# EAGLE board 7x7RGB-IR-J010129A (EAGLE 7.7.0), part 1 of 2
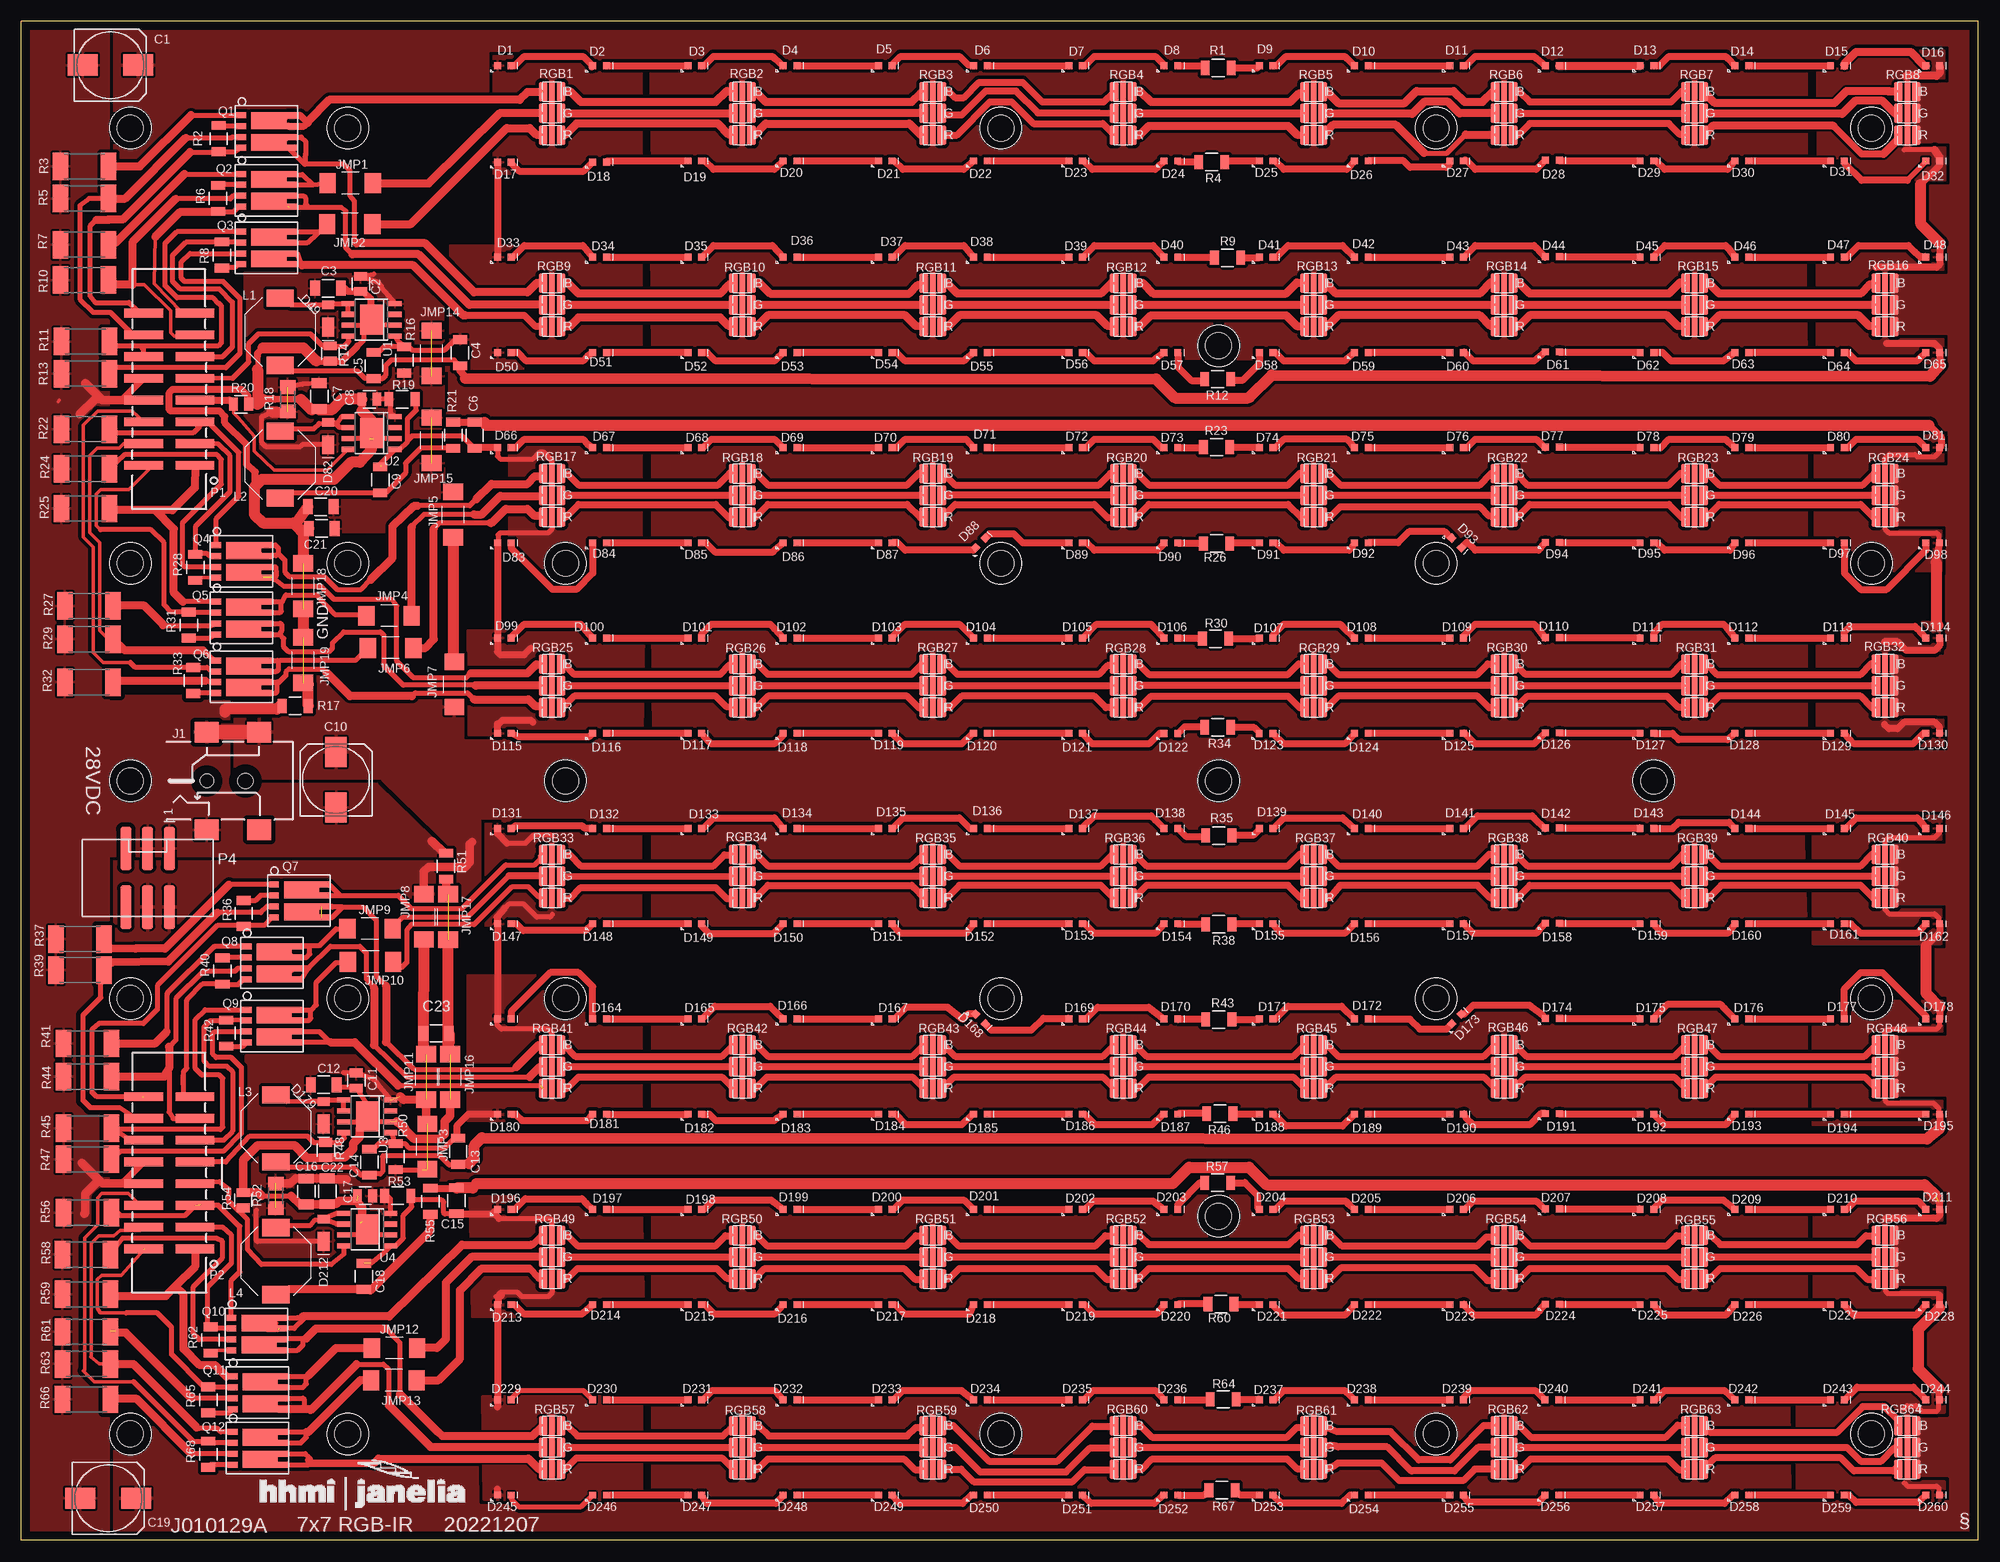
[diagram p4: board, top side]

Size 228.35 x 177.29 mm. Coordinates in mm from the lower left corner, seen from the top.
Outline: 228.35,177.29 0,177.29 0,0 228.35,0 228.35,177.29
Copper layers (1*16): Top 0.035mm / dielectric 1.5mm / Bottom 0.035mm
Design rules "default": minimum track width 10mil, minimum drill 24mil, track to track 8mil, track to pad 8mil, pad to pad 8mil, via to via 8mil, smd to smd 8mil, copper to edge 40mil, drill to drill 8mil, minimum pad ring 10mil, minimum via ring 8mil, stop-mask expansion 4mil, vias tented up to drill 0mil, thermal gap 10mil

## Footprints (pad centres in the part's own frame; a part is rotated, then mirrored left to right if it is on the bottom)
153CLV-0810 = smd 3.5 x 2.5: + 3.25,0; - -3.25,0
0805S = smd 1.016 x 1.524: 1 -0.889,0; 2 0.889,0
1210S = smd 1.14 x 1.75: 1 -1.5,0; 2 1.5,0
1206S = smd 1.016 x 1.651: 1 -1.524,0; 2 1.524,0
LED_SFH4050 = smd 0.8 x 0.8: A -0.8,0; C 0.8,0
PWRDI-123 = smd 1 x 1.4: A 1.6,0 | smd 2.2 x 1.4: K -1,0
PJ-002 = smd 2.8 x 2.4: 1A 5,5.7; 1B 11.1,5.7; 2 5,-5.7; 3 11.1,-5.7 | hole 1.6: 5,0 | hole 1.8: 9.5,0
5100 = smd 1.91 x 2.31: 1 -2.65,0; 2 2.65,0
SRU8043 = smd 2.007 x 3.2: 1 -3.912,0; 2 3.912,0
HEADER2X8_SM_SMALL = smd 1.02 x 4.5: 1 -8.89,-3; 2 -8.89,3; 3 -6.35,-3; 4 -6.35,3; 5 -3.81,-3; 6 -3.81,3; 7 -1.27,-3; 8 -1.27,3; 9 1.27,-3; 10 1.27,3; 11 3.81,-3; 12 3.81,3; 13 6.35,-3; 14 6.35,3; 15 8.89,-3; 16 8.89,3
2X3_SHROUDED_SMT = smd 5.08 x 1.27: 1 -3.429,2.54; 2 3.429,2.54; 3 -3.429,0; 4 3.429,0; 5 -3.429,-2.54; 6 3.429,-2.54
LFPAK56D = smd 0.7 x 1.15: 1 -1.905,-3.275; 2 -0.635,-3.275; 3 0.635,-3.275; 4 1.905,-3.275 | smd 0.7 x 1.9: 5 1.905,2.225; 6 0.635,2.225; 7 -0.635,2.225; 8 -1.905,2.225 | smd 1.97 x 4.1: 56 1.27,-0.05; 78 -1.27,-0.05
R2512 = smd 1.8 x 3.2: 1 -2.8,0; 2 2.8,0
R1206 = smd 1.6 x 1.803: 1 -1.422,0; 2 1.422,0
SUNPLUS_RGB = smd 1 x 2.286: BA -1.05,-2.54; BC 1.05,-2.54; GA -1.05,0; GC 1.05,0; RA -1.05,2.54; RC 1.05,2.54 | smd 0.69 x 7.62: T 0,0
4-40SOCKET = hole 3.048: 0,0
SOIC8-EP = smd 0.6 x 1.5: 1 -1.905,-2.75; 2 -0.635,-2.75; 3 0.635,-2.75; 4 1.905,-2.75; 5 1.905,2.75; 6 0.635,2.75; 7 -0.635,2.75; 8 -1.905,2.75 | smd 3.502 x 2.613: EP 0,0

## Placement (x,y rotation side)
C1  [153CLV-0810]  10.39,172.18 0 top
C2  0.1  [0805S]  39.6,146.66 270 top
C3  10@50  [1210S]  35.79,146.15 0 top
C4  2.2@50  [1206S]  51.18,138.62 270 top
C5  2.2@50  [1206S]  41.12,137.13 270 top
C6  2.2@50  [1206S]  52.89,128.99 90 top
C7  10@50  [1210S]  34.77,133.58 270 top
C8  0.1  [0805S]  40.61,133.19 180 top
C9  2.2@50  [1206S]  41.88,123.8 270 top
C10  [153CLV-0810]  36.7,88.77 90 top
C11  0.1  [0805S]  39.09,53.69 270 top
C12  10@50  [1210S]  35.28,53.18 0 top
C13  2.2@50  [1206S]  50.96,45.43 270 top
C14  2.2@50  [1206S]  40.61,44.17 270 top
C15  2.2@50  [1206S]  50.77,39.66 90 top
C16  10@50  [1210S]  33.25,40.74 270 top
C17  0.1  [0805S]  40.1,40.23 180 top
C18  2.2@50  [1206S]  39.98,30.83 270 top
C19  [153CLV-0810]  10.13,4.92 0 top
C20  10@50  [1210S]  34.92,120.65 180 top
C21  10@50  [1210S]  35.05,118.11 180 top
C22  10@50  [1210S]  35.69,40.77 270 top
C23  10@50  [1210S]  48.39,59.18 0 top
D1  [LED_SFH4050]  56.36,172.11 0 top
D2  [LED_SFH4050]  67.47,172.11 0 top
D3  [LED_SFH4050]  78.58,172.12 0 top
D4  [LED_SFH4050]  89.7,172.12 0 top
D5  [LED_SFH4050]  100.81,172.12 0 top
D6  [LED_SFH4050]  111.92,172.12 0 top
D7  [LED_SFH4050]  123.03,172.12 0 top
D8  [LED_SFH4050]  134.15,172.12 0 top
D9  [LED_SFH4050]  145.26,172.12 0 top
D10  [LED_SFH4050]  156.37,172.12 0 top
D11  [LED_SFH4050]  167.48,172.12 0 top
D12  [LED_SFH4050]  178.66,172.12 0 top
D13  [LED_SFH4050]  189.71,172.12 0 top
D14  [LED_SFH4050]  200.78,172.12 0 top
D15  [LED_SFH4050]  211.93,172.12 0 top
D16  [LED_SFH4050]  223.05,172.12 0 top
D17  [LED_SFH4050]  56.36,160.88 0 top
D18  [LED_SFH4050]  67.47,160.88 0 top
D19  [LED_SFH4050]  78.58,161.01 0 top
D20  [LED_SFH4050]  89.7,161.01 0 top
D21  [LED_SFH4050]  100.81,161.01 0 top
D22  [LED_SFH4050]  111.92,161.01 0 top
D23  [LED_SFH4050]  123.03,161.01 0 top
D24  [LED_SFH4050]  134.15,161.01 0 top
D25  [LED_SFH4050]  145.26,161.01 0 top
D26  [LED_SFH4050]  156.37,161.01 0 top
D27  [LED_SFH4050]  167.48,161.01 0 top
D28  [LED_SFH4050]  178.66,161.08 0 top
D29  [LED_SFH4050]  189.71,161.01 0 top
D30  [LED_SFH4050]  200.78,161.01 0 top
D31  [LED_SFH4050]  211.93,161.01 0 top
D32  [LED_SFH4050]  223.05,161.01 0 top
D33  [LED_SFH4050]  56.36,149.77 0 top
D34  [LED_SFH4050]  67.47,149.77 0 top
D35  [LED_SFH4050]  78.58,149.77 0 top
D36  [LED_SFH4050]  89.7,149.77 0 top
D37  [LED_SFH4050]  100.81,149.77 0 top
D38  [LED_SFH4050]  111.92,149.77 0 top
D39  [LED_SFH4050]  123.03,149.77 0 top
D40  [LED_SFH4050]  134.15,149.77 0 top
D41  [LED_SFH4050]  145.26,149.77 0 top
D42  [LED_SFH4050]  156.37,149.77 0 top
D43  [LED_SFH4050]  167.48,149.77 0 top
D44  [LED_SFH4050]  178.66,149.84 0 top
D45  [LED_SFH4050]  189.71,149.77 0 top
D46  [LED_SFH4050]  200.78,149.77 0 top
D47  [LED_SFH4050]  211.93,149.77 0 top
D48  [LED_SFH4050]  223.05,149.77 0 top
D49  DLFS240L  [PWRDI-123]  35.79,142.59 90 top
D50  [LED_SFH4050]  56.36,138.66 0 top
D51  [LED_SFH4050]  67.47,138.66 0 top
D52  [LED_SFH4050]  78.58,138.66 0 top
D53  [LED_SFH4050]  89.7,138.66 0 top
D54  [LED_SFH4050]  100.81,138.66 0 top
D55  [LED_SFH4050]  111.92,138.66 0 top
D56  [LED_SFH4050]  123.03,138.66 0 top
D57  [LED_SFH4050]  134.15,138.66 0 top
D58  [LED_SFH4050]  145.26,138.66 0 top
D59  [LED_SFH4050]  156.37,138.66 0 top
D60  [LED_SFH4050]  167.48,138.66 0 top
D61  [LED_SFH4050]  178.66,138.73 0 top
D62  [LED_SFH4050]  189.71,138.66 0 top
D63  [LED_SFH4050]  200.78,138.66 0 top
D64  [LED_SFH4050]  211.93,138.66 0 top
D65  [LED_SFH4050]  223.05,138.66 0 top
D66  [LED_SFH4050]  56.36,127.55 0 top
D67  [LED_SFH4050]  67.47,127.55 0 top
D68  [LED_SFH4050]  78.58,127.55 0 top
D69  [LED_SFH4050]  89.7,127.55 0 top
D70  [LED_SFH4050]  100.81,127.55 0 top
D71  [LED_SFH4050]  111.92,127.55 0 top
D72  [LED_SFH4050]  123.03,127.55 0 top
D73  [LED_SFH4050]  134.15,127.55 0 top
D74  [LED_SFH4050]  145.26,127.55 0 top
D75  [LED_SFH4050]  156.37,127.55 0 top
D76  [LED_SFH4050]  167.48,127.55 0 top
D77  [LED_SFH4050]  178.66,127.62 0 top
D78  [LED_SFH4050]  189.71,127.55 0 top
D79  [LED_SFH4050]  200.78,127.55 0 top
D80  [LED_SFH4050]  211.93,127.55 0 top
D81  [LED_SFH4050]  223.05,127.55 0 top
D82  DLFS240L  [PWRDI-123]  35.79,128.88 90 top
D83  [LED_SFH4050]  56.36,116.43 0 top
D84  [LED_SFH4050]  67.47,116.43 0 top
D85  [LED_SFH4050]  78.58,116.43 0 top
D86  [LED_SFH4050]  89.7,116.43 0 top
D87  [LED_SFH4050]  100.81,116.43 0 top
D88  [LED_SFH4050]  111.92,116.43 45 top
D89  [LED_SFH4050]  123.03,116.43 0 top
D90  [LED_SFH4050]  134.15,116.43 0 top
D91  [LED_SFH4050]  145.26,116.43 0 top
D92  [LED_SFH4050]  156.37,116.43 0 top
D93  [LED_SFH4050]  167.48,116.43 315 top
D94  [LED_SFH4050]  178.66,116.5 0 top
D95  [LED_SFH4050]  189.71,116.43 0 top
D96  [LED_SFH4050]  200.78,116.43 0 top
D97  [LED_SFH4050]  211.93,116.43 0 top
D98  [LED_SFH4050]  223.05,116.43 0 top
D99  [LED_SFH4050]  56.36,105.32 0 top
D100  [LED_SFH4050]  67.47,105.32 0 top
D101  [LED_SFH4050]  78.58,105.32 0 top
D102  [LED_SFH4050]  89.7,105.32 0 top
D103  [LED_SFH4050]  100.81,105.32 0 top
D104  [LED_SFH4050]  111.92,105.32 0 top
D105  [LED_SFH4050]  123.03,105.32 0 top
D106  [LED_SFH4050]  134.15,105.32 0 top
D107  [LED_SFH4050]  145.26,105.32 0 top
D108  [LED_SFH4050]  156.37,105.32 0 top
D109  [LED_SFH4050]  167.48,105.32 0 top
D110  [LED_SFH4050]  178.66,105.39 0 top
D111  [LED_SFH4050]  189.71,105.32 0 top
D112  [LED_SFH4050]  200.78,105.32 0 top
D113  [LED_SFH4050]  211.93,105.32 0 top
D114  [LED_SFH4050]  223.05,105.32 0 top
D115  [LED_SFH4050]  56.36,94.21 0 top
D116  [LED_SFH4050]  67.47,94.21 0 top
D117  [LED_SFH4050]  78.58,94.21 0 top
D118  [LED_SFH4050]  89.7,94.21 0 top
D119  [LED_SFH4050]  100.81,94.21 0 top
D120  [LED_SFH4050]  111.92,94.21 0 top
D121  [LED_SFH4050]  123.03,94.21 0 top
D122  [LED_SFH4050]  134.15,94.2 0 top
D123  [LED_SFH4050]  145.26,94.2 0 top
D124  [LED_SFH4050]  156.37,94.21 0 top
D125  [LED_SFH4050]  167.48,94.21 0 top
D126  [LED_SFH4050]  178.66,94.28 0 top
D127  [LED_SFH4050]  189.71,94.21 0 top
D128  [LED_SFH4050]  200.78,94.21 0 top
D129  [LED_SFH4050]  211.93,94.21 0 top
D130  [LED_SFH4050]  223.05,94.21 0 top
D131  [LED_SFH4050]  56.36,83.09 0 top
D132  [LED_SFH4050]  67.47,83.09 0 top
D133  [LED_SFH4050]  78.58,83.09 0 top
D134  [LED_SFH4050]  89.7,83.09 0 top
D135  [LED_SFH4050]  100.81,83.09 0 top
D136  [LED_SFH4050]  111.92,83.09 0 top
D137  [LED_SFH4050]  123.03,83.09 0 top
D138  [LED_SFH4050]  134.14,83.09 0 top
D139  [LED_SFH4050]  145.26,83.09 0 top
D140  [LED_SFH4050]  156.37,83.09 0 top
D141  [LED_SFH4050]  167.48,83.09 0 top
D142  [LED_SFH4050]  178.66,83.16 0 top
D143  [LED_SFH4050]  189.71,83.09 0 top
D144  [LED_SFH4050]  200.78,83.09 0 top
D145  [LED_SFH4050]  211.93,83.09 0 top
D146  [LED_SFH4050]  223.05,83.09 0 top
D147  [LED_SFH4050]  56.36,71.98 0 top
D148  [LED_SFH4050]  67.47,71.98 0 top
D149  [LED_SFH4050]  78.58,71.98 0 top
D150  [LED_SFH4050]  89.7,71.98 0 top
D151  [LED_SFH4050]  100.81,71.98 0 top
D152  [LED_SFH4050]  111.92,71.98 0 top
D153  [LED_SFH4050]  123.03,71.98 0 top
D154  [LED_SFH4050]  134.15,71.98 0 top
D155  [LED_SFH4050]  145.26,71.98 0 top
D156  [LED_SFH4050]  156.37,71.98 0 top
D157  [LED_SFH4050]  167.48,71.98 0 top
D158  [LED_SFH4050]  178.66,72.05 0 top
D159  [LED_SFH4050]  189.71,71.98 0 top
D160  [LED_SFH4050]  200.78,71.98 0 top
D161  [LED_SFH4050]  211.93,71.98 0 top
D162  [LED_SFH4050]  223.05,71.98 0 top
D163  [LED_SFH4050]  56.36,60.87 0 top
D164  [LED_SFH4050]  67.47,60.87 0 top
D165  [LED_SFH4050]  78.58,60.87 0 top
D166  [LED_SFH4050]  89.7,60.87 0 top
D167  [LED_SFH4050]  100.81,60.87 0 top
D168  [LED_SFH4050]  111.92,60.87 315 top
D169  [LED_SFH4050]  123.03,60.87 0 top
D170  [LED_SFH4050]  134.15,60.87 0 top
D171  [LED_SFH4050]  145.26,60.87 0 top
D172  [LED_SFH4050]  156.37,60.87 0 top
D173  [LED_SFH4050]  167.48,60.87 45 top
D174  [LED_SFH4050]  178.66,60.94 0 top
D175  [LED_SFH4050]  189.71,60.87 0 top
D176  [LED_SFH4050]  200.78,60.87 0 top
D177  [LED_SFH4050]  211.93,60.87 0 top
D178  [LED_SFH4050]  223.05,60.87 0 top
D179  DLFS240L  [PWRDI-123]  35.28,49.63 90 top
D180  [LED_SFH4050]  56.36,49.76 0 top
D181  [LED_SFH4050]  67.47,49.76 0 top
D182  [LED_SFH4050]  78.58,49.76 0 top
D183  [LED_SFH4050]  89.7,49.76 0 top
D184  [LED_SFH4050]  100.81,49.76 0 top
D185  [LED_SFH4050]  111.92,49.76 0 top
D186  [LED_SFH4050]  123.03,49.76 0 top
D187  [LED_SFH4050]  134.15,49.76 0 top
D188  [LED_SFH4050]  145.26,49.76 0 top
D189  [LED_SFH4050]  156.37,49.76 0 top
D190  [LED_SFH4050]  167.48,49.76 0 top
D191  [LED_SFH4050]  178.66,49.83 0 top
D192  [LED_SFH4050]  189.71,49.76 0 top
D193  [LED_SFH4050]  200.78,49.76 0 top
D194  [LED_SFH4050]  211.93,49.76 0 top
D195  [LED_SFH4050]  223.05,49.76 0 top
D196  [LED_SFH4050]  56.36,38.64 0 top
D197  [LED_SFH4050]  67.47,38.64 0 top
D198  [LED_SFH4050]  78.58,38.64 0 top
D199  [LED_SFH4050]  89.7,38.64 0 top
D200  [LED_SFH4050]  100.81,38.64 0 top
D201  [LED_SFH4050]  111.92,38.64 0 top
D202  [LED_SFH4050]  123.03,38.64 0 top
D203  [LED_SFH4050]  134.15,38.64 0 top
D204  [LED_SFH4050]  145.26,38.64 0 top
D205  [LED_SFH4050]  156.37,38.64 0 top
D206  [LED_SFH4050]  167.48,38.64 0 top
D207  [LED_SFH4050]  178.66,38.71 0 top
D208  [LED_SFH4050]  189.71,38.64 0 top
D209  [LED_SFH4050]  200.78,38.64 0 top
D210  [LED_SFH4050]  211.93,38.64 0 top
D211  [LED_SFH4050]  223.05,38.64 0 top
D212  DLFS240L  [PWRDI-123]  35.28,35.91 90 top
D213  [LED_SFH4050]  56.36,27.53 0 top
D214  [LED_SFH4050]  67.47,27.53 0 top
D215  [LED_SFH4050]  78.58,27.53 0 top
D216  [LED_SFH4050]  89.7,27.53 0 top
D217  [LED_SFH4050]  100.81,27.53 0 top
D218  [LED_SFH4050]  111.92,27.53 0 top
D219  [LED_SFH4050]  123.03,27.53 0 top
D220  [LED_SFH4050]  134.15,27.53 0 top
D221  [LED_SFH4050]  145.26,27.53 0 top
D222  [LED_SFH4050]  156.37,27.53 0 top
D223  [LED_SFH4050]  167.48,27.53 0 top
D224  [LED_SFH4050]  178.66,27.6 0 top
D225  [LED_SFH4050]  189.71,27.53 0 top
D226  [LED_SFH4050]  200.78,27.53 0 top
D227  [LED_SFH4050]  211.93,27.53 0 top
D228  [LED_SFH4050]  223.05,27.53 0 top
D229  [LED_SFH4050]  56.36,16.41 0 top
D230  [LED_SFH4050]  67.47,16.41 0 top
D231  [LED_SFH4050]  78.58,16.41 0 top
D232  [LED_SFH4050]  89.7,16.41 0 top
D233  [LED_SFH4050]  100.81,16.41 0 top
D234  [LED_SFH4050]  111.92,16.41 0 top
D235  [LED_SFH4050]  123.03,16.41 0 top
D236  [LED_SFH4050]  134.15,16.41 0 top
D237  [LED_SFH4050]  145.26,16.41 0 top
D238  [LED_SFH4050]  156.37,16.41 0 top
D239  [LED_SFH4050]  167.48,16.41 0 top
D240  [LED_SFH4050]  178.6,16.41 0 top
D241  [LED_SFH4050]  189.71,16.41 0 top
D242  [LED_SFH4050]  200.78,16.41 0 top
D243  [LED_SFH4050]  211.93,16.41 0 top
D244  [LED_SFH4050]  223.05,16.41 0 top
D245  [LED_SFH4050]  56.36,5.31 0 top
D246  [LED_SFH4050]  67.47,5.31 0 top
D247  [LED_SFH4050]  78.58,5.31 0 top
D248  [LED_SFH4050]  89.7,5.31 0 top
D249  [LED_SFH4050]  100.81,5.31 0 top
D250  [LED_SFH4050]  111.92,5.31 0 top
D251  [LED_SFH4050]  123.03,5.31 0 top
D252  [LED_SFH4050]  134.15,5.31 0 top
D253  [LED_SFH4050]  145.26,5.31 0 top
D254  [LED_SFH4050]  156.37,5.31 0 top
D255  [LED_SFH4050]  167.48,5.31 0 top
D256  [LED_SFH4050]  178.6,5.31 0 top
D257  [LED_SFH4050]  189.71,5.31 0 top
D258  [LED_SFH4050]  200.78,5.31 0 top
D259  [LED_SFH4050]  211.93,5.31 0 top
D260  [LED_SFH4050]  223.05,5.31 0 top
J1  [PJ-002]  16.64,88.65 0 top
JMP1  JUMPER5100  [5100]  38.39,158.4 180 top
JMP2  JUMPER5100  [5100]  38.33,153.64 180 top
JMP3  JUMPER5100  [5100]  47.37,45.97 90 top
JMP4  JUMPER5100  [5100]  42.9,107.92 180 top
JMP5  JUMPER5100  [5100]  50.39,119.73 90 top
JMP6  JUMPER5100  [5100]  43.09,104.17 180 top
JMP7  JUMPER5100  [5100]  50.52,99.92 90 top
JMP8  JUMPER5100  [5100]  46.96,72.79 270 top
JMP9  JUMPER5100  [5100]  40.67,71.41 180 top
JMP10  JUMPER5100  [5100]  40.74,67.54 180 top
JMP11  JUMPER5100  [5100]  47.24,54.1 270 top
JMP12  JUMPER5100  [5100]  43.53,22.45 180 top
JMP13  JUMPER5100  [5100]  43.47,18.7 180 top
JMP14  JUMPER5100  [5100]  47.88,138.56 90 top
JMP15  JUMPER5100  [5100]  47.88,128.4 90 top
JMP16  JUMPER5100  [5100]  50.04,54.1 90 top
JMP17  JUMPER5100  [5100]  49.78,72.77 270 top
JMP18  JUMPER5100  [5100]  32.89,111.38 90 top
JMP19  JUMPER5100  [5100]  32.89,102.74 90 top
L1  68uH/1A  [SRU8043]  30.2,141.07 90 top
L2  68uH/1A  [SRU8043]  30.2,125.57 90 top
L3  68uH/1A  [SRU8043]  29.69,48.1 90 top
L4  68uH/1A  [SRU8043]  29.69,32.61 90 top
P1  [HEADER2X8_SM_SMALL]  17.27,134.37 90 top
P2  [HEADER2X8_SM_SMALL]  17.27,42.93 90 top
P4  CON2X3  [2X3_SHROUDED_SMT]  14.73,77.34 270 top
Q1  NPN_DUAL  [LFPAK56D]  28.93,164.44 270 top
Q2  NPN_DUAL  [LFPAK56D]  28.93,157.58 270 top
Q3  NPN_DUAL  [LFPAK56D]  28.93,150.85 270 top
Q4  NPN_DUAL  [LFPAK56D]  26.01,114.27 270 top
Q5  NPN_DUAL  [LFPAK56D]  26.01,107.67 270 top
Q6  NPN_DUAL  [LFPAK56D]  26.01,100.81 270 top
Q7  NPN_DUAL  [LFPAK56D]  32.74,74.65 270 top
Q8  NPN_DUAL  [LFPAK56D]  29.56,67.41 270 top
Q9  NPN_DUAL  [LFPAK56D]  29.56,60.04 270 top
Q10  NPN_DUAL  [LFPAK56D]  27.78,24.1 270 top
Q11  NPN_DUAL  [LFPAK56D]  27.91,17.24 270 top
Q12  NPN_DUAL  [LFPAK56D]  27.91,10.77 270 top
R1  10R0  [1206S]  139.67,171.87 180 top
R2  10K0  [1206S]  23.02,163.61 90 top
R3  4R99  [R2512]  7.34,160.37 0 top
R4  10R0  [1206S]  138.91,160.88 180 top
R5  4R99  [R2512]  7.34,156.63 0 top
R6  0R0  [1206S]  22.96,156.63 90 top
R7  4R99  [R2512]  7.34,151.23 0 top
R8  10K0  [1206S]  23.4,150.02 90 top
R9  10R0  [1206S]  140.75,149.71 180 top
R10  4R99  [R2512]  7.34,147.1 0 top
R11  4R99  [R2512]  7.46,139.93 0 top
R12  10R0  [1206S]  139.61,135.54 180 top
R13  4R99  [R2512]  7.46,136.18 0 top
R14  4.99K  [0805S]  36.04,138.53 90 top
R16  1R00  [1206S]  44.68,137.77 270 top
R17  [1206S]  31.95,97.41 0 top
R18  0R0  [R1206]  31.09,133.19 90 top
R19  1R00  [1206S]  44.42,133.19 180 top
R20  4.99K  [0805S]  25.63,132.62 180 top
R21  [1206S]  50.39,129 90 top
R22  4R99  [R2512]  7.46,129.7 0 top
R23  10R0  [1206S]  139.48,127.61 180 top
R24  4R99  [R2512]  7.46,125.07 0 top
R25  4R99  [R2512]  7.46,120.43 0 top
R26  10R0  [1206S]  139.48,116.37 180 top
R27  4R99  [R2512]  7.87,109.06 0 top
R28  0R0  [1206S]  20.29,113.57 90 top
R29  4R99  [R2512]  7.87,105.19 0 top
R30  10R0  [1206S]  139.35,105.25 180 top
R31  0R0  [1206S]  19.53,106.84 90 top
R32  4R99  [R2512]  7.87,100.17 0 top
R33  0R0  [1206S]  20.04,100.36 90 top
R34  10R0  [1206S]  139.61,94.9 180 top
R35  10R0  [1206S]  139.73,82.27 180 top
R36  10K0  [1206S]  25.94,73.19 90 top
R37  4R99  [R2512]  6.83,70.2 0 top
R38  10R0  [1206S]  139.73,71.92 180 top
R39  4R99  [R2512]  6.83,66.58 0 top
R40  0R0  [1206S]  23.47,66.46 90 top
R41  4R99  [R2512]  7.72,58.01 0 top
R42  10K0  [1206S]  23.91,59.22 90 top
R43  10R0  [1206S]  139.73,60.8 180 top
R44  4R99  [R2512]  7.72,54.14 0 top
R45  4R99  [R2512]  7.72,48.1 0 top
R46  10R0  [1206S]  139.86,49.82 180 top
R47  4R99  [R2512]  7.72,44.48 0 top
R48  4.99K  [0805S]  35.53,45.56 90 top
R50  1R00  [1206S]  43.66,44.8 270 top
R51  0R0  [1206S]  49.55,78.69 270 top
R52  0R0  [R1206]  29.69,40.23 90 top
R53  1R00  [1206S]  43.91,40.23 180 top
R54  4.99K  [0805S]  25.88,39.72 270 top
R55  0R0  [1206S]  47.72,39.6 90 top
R56  4R99  [R2512]  7.72,38.26 0 top
R57  10R0  [1206S]  139.61,41.75 180 top
R58  4R99  [R2512]  7.59,33.37 0 top
R59  4R99  [R2512]  7.59,28.74 0 top
R60  10R0  [1206S]  139.99,27.59 180 top
R61  4R99  [R2512]  7.59,24.36 0 top
R62  0R0  [1206S]  22.07,23.4 90 top
R63  4R99  [R2512]  7.59,20.61 0 top
R64  10R0  [1206S]  140.24,16.48 180 top
R65  0R0  [1206S]  21.82,16.42 90 top
R66  4R99  [R2512]  7.59,16.48 0 top
R67  10R0  [1206S]  140.12,5.88 180 top
R68  0R0  [1206S]  21.82,10.07 90 top
RGB1  LED_RGB_PADSUNPLUS  [SUNPLUS_RGB]  61.91,166.56 180 top
RGB2  LED_RGB_PADSUNPLUS  [SUNPLUS_RGB]  84.14,166.56 180 top
RGB3  LED_RGB_PADSUNPLUS  [SUNPLUS_RGB]  106.36,166.56 180 top
RGB4  LED_RGB_PADSUNPLUS  [SUNPLUS_RGB]  128.59,166.56 180 top
RGB5  LED_RGB_PADSUNPLUS  [SUNPLUS_RGB]  150.81,166.56 180 top
RGB6  LED_RGB_PADSUNPLUS  [SUNPLUS_RGB]  173.04,166.56 180 top
RGB7  LED_RGB_PADSUNPLUS  [SUNPLUS_RGB]  195.26,166.56 180 top
RGB8  LED_RGB_PADSUNPLUS  [SUNPLUS_RGB]  220.09,166.56 180 top
RGB9  LED_RGB_PADSUNPLUS  [SUNPLUS_RGB]  61.91,144.21 180 top
RGB10  LED_RGB_PADSUNPLUS  [SUNPLUS_RGB]  84.14,144.21 180 top
RGB11  LED_RGB_PADSUNPLUS  [SUNPLUS_RGB]  106.36,144.21 180 top
RGB12  LED_RGB_PADSUNPLUS  [SUNPLUS_RGB]  128.59,144.21 180 top
RGB13  LED_RGB_PADSUNPLUS  [SUNPLUS_RGB]  150.81,144.21 180 top
RGB14  LED_RGB_PADSUNPLUS  [SUNPLUS_RGB]  173.04,144.21 180 top
RGB15  LED_RGB_PADSUNPLUS  [SUNPLUS_RGB]  195.26,144.21 180 top
RGB16  LED_RGB_PADSUNPLUS  [SUNPLUS_RGB]  217.49,144.21 180 top
RGB17  LED_RGB_PADSUNPLUS  [SUNPLUS_RGB]  61.92,121.99 180 top
RGB18  LED_RGB_PADSUNPLUS  [SUNPLUS_RGB]  84.13,121.99 180 top
RGB19  LED_RGB_PADSUNPLUS  [SUNPLUS_RGB]  106.36,121.99 180 top
RGB20  LED_RGB_PADSUNPLUS  [SUNPLUS_RGB]  128.59,121.99 180 top
RGB21  LED_RGB_PADSUNPLUS  [SUNPLUS_RGB]  150.81,121.98 180 top
RGB22  LED_RGB_PADSUNPLUS  [SUNPLUS_RGB]  173.04,121.98 180 top
RGB23  LED_RGB_PADSUNPLUS  [SUNPLUS_RGB]  195.26,121.98 180 top
RGB24  LED_RGB_PADSUNPLUS  [SUNPLUS_RGB]  217.49,121.98 180 top
RGB25  LED_RGB_PADSUNPLUS  [SUNPLUS_RGB]  61.91,99.76 180 top
RGB26  LED_RGB_PADSUNPLUS  [SUNPLUS_RGB]  84.14,99.76 180 top
RGB27  LED_RGB_PADSUNPLUS  [SUNPLUS_RGB]  106.36,99.76 180 top
RGB28  LED_RGB_PADSUNPLUS  [SUNPLUS_RGB]  128.59,99.76 180 top
RGB29  LED_RGB_PADSUNPLUS  [SUNPLUS_RGB]  150.81,99.76 180 top
RGB30  LED_RGB_PADSUNPLUS  [SUNPLUS_RGB]  173.04,99.76 180 top
RGB31  LED_RGB_PADSUNPLUS  [SUNPLUS_RGB]  195.26,99.76 180 top
RGB32  LED_RGB_PADSUNPLUS  [SUNPLUS_RGB]  217.49,99.76 180 top
RGB33  LED_RGB_PADSUNPLUS  [SUNPLUS_RGB]  61.91,77.53 180 top
RGB34  LED_RGB_PADSUNPLUS  [SUNPLUS_RGB]  84.14,77.53 180 top
RGB35  LED_RGB_PADSUNPLUS  [SUNPLUS_RGB]  106.36,77.53 180 top
RGB36  LED_RGB_PADSUNPLUS  [SUNPLUS_RGB]  128.59,77.53 180 top
RGB37  LED_RGB_PADSUNPLUS  [SUNPLUS_RGB]  150.81,77.53 180 top
RGB38  LED_RGB_PADSUNPLUS  [SUNPLUS_RGB]  173.04,77.53 180 top
RGB39  LED_RGB_PADSUNPLUS  [SUNPLUS_RGB]  195.26,77.53 180 top
RGB40  LED_RGB_PADSUNPLUS  [SUNPLUS_RGB]  217.49,77.53 180 top
RGB41  LED_RGB_PADSUNPLUS  [SUNPLUS_RGB]  61.91,55.31 180 top
RGB42  LED_RGB_PADSUNPLUS  [SUNPLUS_RGB]  84.14,55.31 180 top
RGB43  LED_RGB_PADSUNPLUS  [SUNPLUS_RGB]  106.36,55.31 180 top
RGB44  LED_RGB_PADSUNPLUS  [SUNPLUS_RGB]  128.59,55.31 180 top
RGB45  LED_RGB_PADSUNPLUS  [SUNPLUS_RGB]  150.81,55.31 180 top
RGB46  LED_RGB_PADSUNPLUS  [SUNPLUS_RGB]  173.04,55.31 180 top
RGB47  LED_RGB_PADSUNPLUS  [SUNPLUS_RGB]  195.26,55.31 180 top
RGB48  LED_RGB_PADSUNPLUS  [SUNPLUS_RGB]  217.49,55.31 180 top
RGB49  LED_RGB_PADSUNPLUS  [SUNPLUS_RGB]  61.91,33.08 180 top
RGB50  LED_RGB_PADSUNPLUS  [SUNPLUS_RGB]  84.14,33.08 180 top
RGB51  LED_RGB_PADSUNPLUS  [SUNPLUS_RGB]  106.36,33.08 180 top
RGB52  LED_RGB_PADSUNPLUS  [SUNPLUS_RGB]  128.59,33.08 180 top
RGB53  LED_RGB_PADSUNPLUS  [SUNPLUS_RGB]  150.81,33.08 180 top
RGB54  LED_RGB_PADSUNPLUS  [SUNPLUS_RGB]  173.04,33.08 180 top
RGB55  LED_RGB_PADSUNPLUS  [SUNPLUS_RGB]  195.26,33.08 180 top
RGB56  LED_RGB_PADSUNPLUS  [SUNPLUS_RGB]  217.49,33.08 180 top
RGB57  LED_RGB_PADSUNPLUS  [SUNPLUS_RGB]  61.91,10.86 180 top
RGB58  LED_RGB_PADSUNPLUS  [SUNPLUS_RGB]  84.14,10.86 180 top
RGB59  LED_RGB_PADSUNPLUS  [SUNPLUS_RGB]  106.36,10.86 180 top
RGB60  LED_RGB_PADSUNPLUS  [SUNPLUS_RGB]  128.59,10.86 180 top
RGB61  LED_RGB_PADSUNPLUS  [SUNPLUS_RGB]  150.81,10.86 180 top
RGB62  LED_RGB_PADSUNPLUS  [SUNPLUS_RGB]  173.04,10.86 180 top
RGB63  LED_RGB_PADSUNPLUS  [SUNPLUS_RGB]  195.26,10.86 180 top
RGB64  LED_RGB_PADSUNPLUS  [SUNPLUS_RGB]  220.09,10.86 180 top
S1  SCREW  [4-40SOCKET]  12.7,88.65 0 top
S2  SCREW  [4-40SOCKET]  215.9,12.45 0 top
S3  SCREW  [4-40SOCKET]  114.3,12.45 0 top
S4  SCREW  [4-40SOCKET]  165.1,12.45 0 top
S5  SCREW  [4-40SOCKET]  139.7,37.85 0 top
S6  SCREW  [4-40SOCKET]  63.5,63.25 0 top
S7  SCREW  [4-40SOCKET]  114.3,63.25 0 top
S8  SCREW  [4-40SOCKET]  165.1,63.25 0 top
S9  SCREW  [4-40SOCKET]  215.9,63.25 0 top
S10  SCREW  [4-40SOCKET]  139.7,88.65 0 top
S11  SCREW  [4-40SOCKET]  63.5,114.05 0 top
S12  SCREW  [4-40SOCKET]  114.3,114.05 0 top
S13  SCREW  [4-40SOCKET]  165.1,114.05 0 top
S14  SCREW  [4-40SOCKET]  215.9,114.05 0 top
S15  SCREW  [4-40SOCKET]  139.7,139.45 0 top
S16  SCREW  [4-40SOCKET]  165.1,164.85 0 top
S17  SCREW  [4-40SOCKET]  114.3,164.85 0 top
S18  SCREW  [4-40SOCKET]  38.1,164.85 0 top
S19  SCREW  [4-40SOCKET]  38.1,114.05 0 top
S20  SCREW  [4-40SOCKET]  12.7,114.05 0 top
S21  SCREW  [4-40SOCKET]  38.1,63.25 0 top
S22  SCREW  [4-40SOCKET]  12.7,63.25 0 top
S23  SCREW  [4-40SOCKET]  38.1,12.45 0 top
S24  SCREW  [4-40SOCKET]  12.7,12.45 0 top
S25  SCREW  [4-40SOCKET]  63.5,88.65 0 top
S26  SCREW  [4-40SOCKET]  12.7,164.85 0 top
S27  SCREW  [4-40SOCKET]  215.9,164.85 0 top
S28  SCREW  [4-40SOCKET]  190.5,88.65 0 top
U1  AP8802  [SOIC8-EP]  40.87,142.47 90 top
U2  AP8802  [SOIC8-EP]  40.87,129.26 90 top
U3  AP8802  [SOIC8-EP]  40.36,49.5 90 top
U4  AP8802  [SOIC8-EP]  40.36,36.29 90 top
U$19  JFRC-LOGOLOGO_OP  [LOGO_BMP_OP]  37.94,4.98 0 top

## Tracks (layer width: path | path; a pad name or v marks a point on that pad's centre or on a via)
BLU1
  Top 0.61: R2.1 24.95,162.09 Q1.4 | 8.73,154.15 7.97,153.39 7.97,145.26 8.61,144.5 12.54,144.5 14.07,143.1 P1.16 | R2.1 22.89,162.09 | 10.16,154.18 10.13,154.15 | 19.68,162.05 22.73,162.05 R2.1
  Top 0.914: 8.73,154.15 10.13,154.15 | 10.16,154.18 11.81,154.18 19.68,162.05
BLU1F
  Top 0.61: R5.2 7.91,156.63 6.83,155.8 6.83,144.88 8.35,143.35 10.38,143.35 13.18,140.56 13.43,140.56 P1.14 | 19.18,163.7 24.51,163.7 24.64,163.83 25.62,163.83 Q1.3
  Top 0.914: R5.2 12.1,156.63 19.18,163.7
BLU1K  (1 unrouted)
  Top 0.61: Q1.8 30.52,165.71 Q1.78
  Top 0.813: Q1.7 32.99,165.07 33.4,165.48 32.54,166.34 Q1.8
  Top 0.914: 60.8,169.04 59.05,169.04 58.17,168.15 35.94,168.15 33.4,165.61
  Top 1.016: 33.4,165.48 33.4,165.61
BLU1K2
  Top 0.61: 39.12,151.38 38.86,151.51 38.86,156.34 38.35,156.97 38.35,159.89 37.59,160.66 33.16,160.66 33.09,160.6 | 33.09,160.6 Q1.5 | 33.09,160.6 33.09,161.49 33.15,161.8 33.15,163.32 32.67,163.8 Q1.6 30.52,163.17 Q1.56
  Top 0.914: RGB9.BC 60.14,146.75 59.05,145.67 52.83,145.67 47.12,151.38 39.12,151.38
BLU2
  Top 0.61: 20.35,114.91 R28.2 20.35,115.16 | Q4.2 21.94,114.91 21.69,115.16 20.35,115.16 | P1.3 22.96,127.99 24.35,126.59 24.35,122.4 20.35,118.4 20.35,115.16
BLU2F
  Top 0.61: 20.8,130.27 21.05,130.53 21.81,130.53 25.37,126.97 25.37,121.89 22.73,119.25 Q4.1 | 20.8,130.27 20.8,130.02 20.04,129.26 10.58,129.26 R22.2 | 20.8,130.27 20.37,130.27 P1.5
BLU2K1
  Top 0.61: Q4.78 26.34,115.16 27.4,115.16 27.66,115.29 28.04,114.91 Q4.7 28.26,114.94 29.72,114.94 29.97,115.19 | Q4.8 29.62,116.18 29.97,115.82 29.97,115.19 | 29.97,115.19 30.73,114.43 30.73,113.03 31.24,112.52 35.31,112.52 36.83,111 39.62,111 40.77,112.14 | 46.23,120.78 52.32,120.78 53.09,121.54
  Top 0.914: 53.09,121.54 54.86,123.32 59.05,123.32 59.94,124.21 60.54,124.21 RGB17.BC | 40.77,112.14 43.31,114.68 43.31,118.36 45.85,120.78 46.23,120.78
BLU2K2  (1 unrouted)
  Top 0.61: Q4.56 26.59,113.64 Q4.6 29.51,113.64 arc-45 29.69,113.56 29.72,112.9 29.72,112.63 arc-45 29.64,112.45 29.34,112.39 | 29.34,112.39 27.05,112.39 | 29.34,112.39 29.59,112.14 30.61,111.38 34.92,111.38 36.45,109.86 43.18,109.86 43.81,109.09 43.81,102.62 45.72,100.71 51.94,100.71 52.45,101.22 | 60.8,102.36 RGB25.BC
  Top 0.914: 52.45,101.22 59.05,101.22 60.07,102.23 60.8,102.23 RGB25.BC
BLU3  (1 unrouted)
  Top 0.61: Q7.4 29.08,72.52 28.42,71.85 26.39,71.85 R36.1 25.53,71.75 22.86,71.75 15.87,64.77 15.87,61.98 14.22,60.33 9.02,60.33 8.33,59.76 arc45 8.25,59.59 8.25,52.38 8.23,52.35 8.79,51.79 14.19,51.79
BLU3F
  Top 0.406: P2.14 13.05,49.63 13.69,49.5
  Top 0.61: 13.69,49.5 13.36,49.25 11.43,50.55 8,50.55 7.21,51.34 7.21,61.31 9.27,63.37 9.27,67.06 R39.2 10.55,67.44 | Q7.3 28.67,74.01 27.94,73.28 22.86,73.28
  Top 0.914: 22.86,73.28 17.14,67.56 10.55,67.44
BLU3K
  Top 0.61: 34.61,76.58 Q7.8 35.84,76.55 arc-45 36.01,76.48 37.21,75.28 | Q7.78 32.54,75.92 32.77,75.69 32.77,75.82 34.04,75.82 Q7.7 37.21,75.28 | 37.21,75.28 43.97,75.28 45.47,73.79 51.43,73.79 56.51,78.87 59.91,78.87 60.58,79.54 60.58,79.88 RGB33.BC
BLU4
  Top 0.406: R62.2 21.43,25.24 22.58,25.24 | 22.7,36.55 20.75,36.67 P2.3
  Top 0.61: Q10.2 21.88,24.74 R62.2 21.69,25.18 21.69,29.56 24.48,32.36 24.48,35.66 23.47,36.55 22.7,36.55 20.54,36.55 20.45,36.45
BLU4F  (1 unrouted)
  Top 0.61: 22.2,39.21 20.93,39.21 | R56.2 10.71,39.09 10.71,38.82 11.56,37.97 19.13,37.97 P2.5 22.99,39.12 25.43,36.67 25.5,36.67 25.5,31.34 24.51,30.35 Q10.1
G1
  Top 0.61: 16.51,106.81 22.12,106.81 Q5.3
  Top 0.914: 16.51,106.81 16.51,106.93 14.35,109.09 11.43,109.09 11.3,108.97 10.77,108.97 R27.2
G4  (1 unrouted)
  Top 0.61: 10.39,25.49 R61.2 10.42,24.38 | Q11.3 19.97,16.61
  Top 0.914: 19.97,16.61 19.84,16.61 12.19,24.26 11.05,24.26 10.92,24.38
G4A
  Top 0.61: R65.1 24.19,14.89 Q11.4
G4A1
  Top 0.61: R31.1 21.91,105.32 Q5.4
GRN1
  Top 0.406: 18.7,143.23 18.7,143.35 15.49,146.69 15.62,152.15
  Top 0.61: Q2.4 25.37,155.67 24.74,155.04 23.02,155.04 R6.1 | 22.58,154.97 R6.1 | P1.15 18.7,143.23 | 22.92,155.07 R6.1
  Top 0.914: 15.62,152.15 18.54,155.07 22.92,155.07
GRN1F
  Top 0.406: 18.51,140.56 17.81,140.56 17.4,140.97 17.4,143.51 14.35,146.56 12.95,146.56
  Top 0.61: 18.51,140.56 P1.13 | 10.68,146.56 R10.2 | Q2.3 24.74,156.94 24.38,156.59 18.03,156.59 | 12.95,146.81 12.95,146.56
  Top 0.914: 12.95,146.56 10.68,146.56 | 18.03,156.59 12.95,151.51 12.95,146.81
GRN1K
  Top 0.914: JMP1.1 47.53,158.4 55.88,166.62 60.8,166.62 RGB1.GC
GRN1K2  (1 unrouted)
  Top 0.61: 38.61,150.11 37.85,150.88 37.85,155.19 37.34,155.57 33.53,155.57 | 33.53,155.57 31.25,155.57 | Q2.6 32.92,156.94 33.15,156.72 33.15,155.96 33.53,155.57 | Q2.5 29.51,155.67 Q2.56
  Top 0.914: RGB9.GC 52.26,144.21 46.35,150.11 38.61,150.11
GRN2
  Top 0.406: P1.2 15.21,125.32 12.54,122.65 9.24,122.65 8.73,122.15 8.73,118.46 9.21,117.98
  Top 0.61: Q5.2 22.29,108.37 R31.2 17.49,108.37 16.64,109.22 16.64,116.46 15.11,117.98 9.21,117.98
GRN2F
  Top 0.61: 10.33,120.49 R25.2 10.45,120.24 | Q5.1 18.82,109.57
  Top 0.914: 15.59,120.24 17.62,120.24 20.24,122.86 P1.1 | 15.59,120.24 10.45,120.24 | 15.59,120.24 17.78,118.05 17.78,110.62 18.82,109.57
GRN2K1
  Top 0.61: 52.83,119.76 46.99,119.76 45.55,118.32
  Top 0.914: 52.83,119.76 53.72,119.76 55.88,121.92 60.8,121.92 RGB17.GC | JMP4.1 45.55,118.32
GRN2K2
  Top 0.305: Q5.5 26.21,105.76 Q5.56
  Top 0.61: Q5.5 30.13,105.76 30.17,105.72 | Q5.6 30.15,107.03 arc-45 30.33,106.96 30.35,106.93 30.35,106.15 arc45 30.17,105.72 | 30.17,105.72 30.61,105.28 30.61,104.27 31.11,103.76 35.94,103.76 36.32,104.14 36.32,104.78 37.59,106.05 41.91,106.05 42.29,105.66 42.29,102.11 44.58,99.82 52.96,99.82
  Top 0.914: RGB25.GC 53.03,99.75 52.96,99.82
GRN3
  Top 0.61: Q8.4 25.88,65.5 25.24,64.87 23.53,64.87 R40.1 | 20.37,51.87 P2.15 19.53,51.74 19.32,51.87 18.92,51.89 | 23.34,64.81 R40.1 | 18.92,51.89 18.89,54.33 | R40.1 21.12,64.93 19.38,63.19 arc45 19.3,63.01 19.3,55.12 19,54.81 arc45 18.92,54.63 18.92,51.89
GRN3F
  Top 0.61: 17.24,55.09 17.24,50.01 17.7,49.25 P2.13 | Q8.3 25.24,66.77 24.89,66.42 21.31,66.42 arc45 21.13,66.35 18.03,63.25 18.03,58.53 arc-45 17.96,58.35 17.24,57.63
  Top 0.914: R44.2 16.67,54.14 17.24,55.09 17.24,57.63
GRN3K
  Top 0.61: JMP9.1 43.02,70.98 42.79,70.98 44.58,72.77 52.07,72.77 56.9,77.6
  Top 0.813: 56.9,77.6 60.67,77.6 RGB33.GC
GRN4  (1 unrouted)
  Top 0.406: 14.32,34.01 11.66,30.96 9.37,30.96 8.86,30.45 8.86,27.15 9.21,26.54 12.19,26.54
  Top 0.61: Q11.2 24.57,17.94 R65.2 21.3,17.94 17.53,21.72 17.53,24.89 15.87,26.54 12.19,26.54
GRN4F
  Top 0.61: 10.58,28.55 R59.2 | Q11.1 23.9,19.15
  Top 0.914: 10.58,28.55 16.86,28.55 17.97,29.65 | 23.9,19.15 22.61,20.45 20.83,20.45 18.92,22.35 18.92,28.7 17.97,29.65 | P2.1 20.27,31.96 17.97,29.65
GULA_1
  Top 0.305: Q11.5 28.5,15.34 Q11.56
  Top 0.61: 42.9,15.78 42.9,19.91 42.23,20.57 39.12,20.57 | Q11.6 32.86,16.61 32.99,16.48 32.99,15.59 33.75,15.34 | 60.8,10.92 RGB57.GC
  Top 0.914: Q11.5 33.75,15.34 33.75,15.21 39.12,20.57 | 42.9,15.78 47.75,10.92 60.8,10.92
GULA_2
  Top 0.305: Q12.6 28.5,10.13 Q12.56
  Top 0.61: Q12.5 33.5,8.86 33.5,9.37 33.5,9.75 33.12,10.13 Q12.6 | 33.63,9.5 33.63,9.05
  Top 0.813: 33.63,9.5 33.5,9.37
  Top 0.914: 33.63,9.05 41.15,9.02 41.68,9.55 59.18,9.55 60.41,8.32 RGB57.RC
GULA_3
  Top 0.61: Q8.56 31.02,66.14 Q8.6 31.69,66.8 33.53,66.8 | 33.53,66.8 36.07,69.34 39.5,69.34 40.26,68.58 40.26,65.53 41.15,64.52 | Q8.5 32.12,65.5 arc45 32.68,65.58 32.77,65.66 33.53,66.8 | 41.15,57.78 44.96,54.1 59.31,54.1 | 60.8,55.24 RGB41.GC
  Top 0.914: 41.15,64.52 41.15,57.78 | 59.31,54.1 60.45,55.24 60.8,55.24
GULA_4  (1 unrouted)
  Top 0.406: Q9.56 29.64,58.14 Q9.5
  Top 0.61: Q9.5 36.04,58.14 34.77,59.41 Q9.6 | 43.94,53.09 60.55,53.09
  Top 0.914: 36.04,58.14 38.89,58.14 43.94,53.09
HS1
  pour Top (isolate 0.381): 73.41,172.59 73.66,160.66 208.28,161.04 208.28,172.97
HS2
  pour Top (isolate 0.381): 73.53,151.51 73.66,138.05 208.28,137.8 208.15,151.26
HS3
  pour Top (isolate 0.381): 73.66,129.03 73.66,115.19 208.28,115.44 208.28,128.78 206.25,128.78
HS4
  pour Top (isolate 0.381): 73.66,107.7 73.79,93.22 133.98,93.22 135,94.23 144.91,94.23 146.18,93.09 178.94,92.84 179.83,93.73 208.28,93.47 208.28,107.31
HS5
  pour Top (isolate 0.381): 73.66,84.33 73.66,70.48 208.28,70.48 207.9,83.31 178.56,83.44 178.18,84.2 145.03,84.07 144.14,83.06 135.13,83.06 134.24,84.07
HS6
  pour Top (isolate 0.381): 73.66,62.74 73.66,48.01 208.28,48.01 208.28,62.99 205.23,62.99
HS7
  pour Top (isolate 0.381): 208.28,27.43 208.28,40.51 73.66,39.88 73.66,26.92
HS8
  pour Top (isolate 0.381): 206.25,16.64 206.38,4.7 73.66,4.7 73.66,17.02
I_RET4  (1 unrouted)
  Top 0.61: 219.71,6.73 220.09,6.35 223.52,6.35 223.77,6.1 223.77,5.38 D260.C | 219.71,15.39 220.04,15.72 221.13,15.72 221.79,15.06 223.5,15.06 223.75,15.32 223.75,16.32 D244.C | 217.55,29.08 217.81,28.83 223.65,28.83 223.85,28.63
  Top 0.813: 223.85,28.63 D228.C 223.85,27.12 | 223.77,17.65 223.77,16.49 D244.C | R55.2 50.61,41.12 arc45 C15.2 50.8,41.15 | 143.28,43.56 arc-45 143.33,43.49 | 223.77,39.5 arc-45 223.85,39.32 D211.C 223.85,37.92 223.52,37.59 217.55,37.59 | 53.09,41.66 52.7,41.15
  Top 1.27: 223.85,27.12 221.36,24.64 221.36,20.07 223.77,17.65 | 53.09,41.66 134.37,41.66 136.27,43.56 143.28,43.56 | 143.33,43.49 145.29,41.53 222.12,41.53 223.39,40.26 | 52.7,41.15 50.8,41.15
  pour Top (isolate 0.254): 207.26,17.02 207.26,4.57 224.41,4.7 224.41,6.86 220.22,6.86 220.22,14.99 224.41,14.99 224.41,17.14
  pour Top (isolate 0.381): 209.17,40.01 209.17,26.42 224.15,26.67 224.15,29.21 217.81,29.21 217.81,37.34 224.15,37.34 224.15,40.26
IGND  (6 unrouted)
  Top 0.61: 39.79,37.25 39.72,35.79 39.59,35.79 39.47,35.66 | 39.47,35.66 40.1,35.66 | 39.47,35.66 U4.7 | U4.2 40.61,35.66 U4.EP 39.59,37.05 39.59,35.4 | U3.EP 40.36,50.9 C11.2 38.32,52.93 37.21,52.96 36.78,52.96 C12.2 | U3.2 40.36,48.87 U3.EP | U3.7 39.09,48.87 U3.EP | U3.EP 39.85,49.37 39.85,48.48 39.47,48.1 | 28.04,40.23 31.47,40.23
  Top 1.016: JMP16.1 50.04,49.53 49.4,48.9 49.4,47.37 48.77,46.86 45.85,46.86 44.83,47.88 44.83,48.01 44.07,48.77 43.94,48.77 43.81,48.9 | JMP16.2 49.78,57.91 | R51.2 49.55,75.65 JMP17.1 | 39.47,48.1 39.47,47.09 38.73,46.36 38.73,45.72 37.72,44.7 35.56,44.7 R48.1 33.3,44.68 31.88,46.1 27.56,46.1 25.91,44.45 25.91,40.64 R54.1 27.66,40.61 28.04,40.23 | U4.EP 39.75,36.9 39.75,38.86 39.5,39.12 39.5,39.24 39.12,39.62 37.08,39.62 36.73,39.27 C22.2 35.66,39.24 C16.2 32.51,39.21 31.47,40.23
  Top 1.27: 49.78,70.1 49.78,57.91 49.89,58.02 C23.2
IGND1  (3 unrouted)
  Top 0.61: 40.23,128.75 40.1,128.75 39.98,128.62 | 39.98,128.62 40.61,128.62 | 39.98,128.62 U2.7 | U2.2 41.12,128.62 U2.EP | U1.2 40.86,141.83 U1.EP | U1.7 39.59,141.83 U1.EP | U1.EP 40.36,142.34 40.36,141.45 39.98,141.07 39.98,140.18 39.21,139.42 | 33.88,131.95 C7.2 35,132.18 | 27.56,138.18 27.56,136.68
  Top 0.762: 29.56,133.19 32.61,133.19
  Top 0.813: 40.86,127.35 U2.EP 40.86,130.71 | 29.56,133.19 28.16,133.19 | 27.56,132.59 R20.1 | 34.77,131.95 C7.2 | 39.75,131.83 39.75,133.17 C8.2 | 27.56,138.18 27.56,138.56 28.19,139.19 | 34.42,137.67 36.01,137.67 R14.1 37.44,137.64 39.21,139.42 | C3.2 37.75,146.15 38.1,145.8 39.57,145.8 C2.2 39.91,145.77 40.77,144.91 40.77,142.56 U1.EP | 27.3,123.06 27.3,124.71 26.29,125.6 26.29,127.89 23.75,130.43 23.75,131.19 23.11,131.83 17.4,131.83 17.27,131.95 17.27,133.99 17.65,134.37 25.65,134.37 26.42,133.6 26.42,132.72
  Top 1.27: 32.61,133.19 33.88,131.95 | 40.86,127.35 39.5,125.86 38.48,125.86 36.45,123.83 28.07,123.83 27.3,123.06 27.18,122.94 27.18,119.76 28.19,118.75 31.75,118.75 32.07,118.43 | 32.07,118.43 32.89,117.6 | 32.89,117.6 JMP18.2 | JMP18.1 JMP19.2 | R17.2 33.47,99.91 JMP19.1 | C20.2 32.13,118.87 32.07,118.43 | C21.2 33.4,118.11 32.89,117.6 | 28.16,133.19 27.56,132.59 27.56,136.68 | C8.2 37.44,133.19 36.19,131.95 34.77,131.95 | 40.86,130.71 39.75,131.83 | 28.19,139.19 32.89,139.19 34.42,137.67
IR_1
  Top 0.61: P1.9 24.61,135.61 26.54,137.54 26.54,139.7 27.69,140.84 33.72,140.84 35.15,139.42 R14.2 37.69,139.42 38.2,139.93 38.2,140.48 U1.8
IR_2
  Top 0.406: U2.8 35.7,124.94 29.49,124.94 27.18,127.13 27.18,128.91 26.03,130.18 25.27,131.06 24.76,131.57 24.76,132.59 R20.2
  Top 0.813: P1.7 24.26,133.1 R20.2
IR_3
  Top 0.406: 20.54,44.17 20.5,44.17 P2.9
  Top 0.61: 20.54,44.17 23.85,44.17 26.64,47.22 33.37,47.22 34.13,46.45 R48.2 37.18,46.45 37.69,46.96 37.69,47.51 U3.8
IR_4
  Top 0.406: 21.05,41.75 20.24,41.63 P2.7
  Top 0.61: 21.05,41.75 23.08,41.88 24.23,40.99 24.19,39.57 24.31,39.46 | U4.8 37.61,33.42 36.17,32.23 28.04,32.23 26.39,34.01 26.39,37.44 24.31,39.46 | 24.31,39.46 24.37,39.46 24.99,38.83 R54.2
IR_DRV3
  Top 0.61: U3.1 43.36,47.13 43.4,46.58 43.53,46.45 | 43.53,46.45 R50.1 44.73,46.33 45.21,45.85 49.4,45.85 50.42,46.86 50.74,46.86 C13.1 | C14.1 41.12,45.69 41.88,46.45 43.53,46.45 | 61.98,73.1 61.67,72.75 60.15,72.75 58.62,74.27 56.87,74.27 56.39,73.79 | 56.64,81.41 58.85,81.41 59.84,82.4 61.67,82.4 61.98,82.27 | RGB41.T 61.92,59.24 61.47,59.69 56.01,59.69 55.5,60.2 55.5,60.81 D163.A
  Top 0.813: D131.A 55.56,82.49 56.64,81.41 | 56.39,73.79 55.5,72.77 55.5,72.04 D147.A D163.A | D180.A 52.27,49.76 arc45 52.09,49.68 50.8,48.39 50.8,47.04 arc45 C13.1
  pour Top (isolate 0.381): 54.1,83.69 54.1,71.75 72.39,71.63 72.39,83.57
  pour Top (isolate 0.406): 52.07,65.91 52.07,49.02 72.39,49.02 72.39,65.91
IR_DRV4  (1 unrouted)
  Top 0.61: 40.74,32.36 42.34,33.63 U4.1 | 42.64,33.92 U4.1 | U4.1 43.66,34.39 44.55,35.28 44.55,37.94 45.56,38.96 45.56,39.62 | R53.1 45.56,39.72 45.56,39.62 | 50.68,38.1 49.4,38.1 49.28,38.23 49.28,39.5 49.02,39.75 45.69,39.75 45.56,39.62 | 55.74,37.59 61.72,37.59 61.92,37.4 | 61.92,37.4 61.98,37.34 | 61.92,37.4 RGB49.T 61.92,28.9 61.47,28.45 58.42,28.45 57.91,28.96 55.88,28.96 55.37,28.45
  Top 0.813: 55.56,15.56 D229.A D213.A 55.63,27.6 55.63,28.45 56.01,28.58 | D245.A 55.56,6.03 | 50.68,38.1 arc45 C15.1 54.95,38.13 arc45 55.13,38.21 | 55.13,38.21 D196.A | 55.74,37.59 55.13,38.21
  pour Top (isolate 0.406): 52.32,40.13 52.58,26.16 72.64,26.16 72.39,40.13
  pour Top: 72.39,16.76 53.85,16.76 53.97,4.83 72.39,4.83
IR_DRV_UL1
  Top 0.61: U1.1 43.87,140.1 44.29,139.67 | 44.29,139.67 R16.1 45.13,139.29 arc-45 45.31,139.22 45.59,138.94 49.3,138.94 arc45 49.48,139.01 50.55,140.08 arc-45 50.59,140.18 C4.1 | C5.1 41.63,138.66 42.39,139.42 44.04,139.42 44.29,139.67
  Top 0.813: D17.A D33.A
  pour Top (isolate 0.381): 72.39,173.23 72.39,159.51 55.12,159.51 55.12,173.23
  pour Top (isolate 0.381): 72.39,151.13 72.39,135.38 50.04,135.38 50.04,151.13
IR_DRV_UL2  (1 unrouted)
  Top 0.61: 42.01,125.45 41.58,125.32 U2.1 | 43.15,126.89 U2.1 | U2.1 44.17,127.35 45.06,128.24 45.06,128.26 | 45.06,128.26 45.06,130.91 46.07,131.92 46.07,132.69 R19.1 | 45.06,128.26 arc-45 45.13,128.44 45.59,128.91 51.43,128.91 52.38,127.96 C6.1 | D66.A 55.56,126.56 55.88,126.24 59.69,126.24 60.45,127 60.96,127 61.92,126.04 RGB17.T 61.92,118.05 61.47,117.6 55.88,117.6 55.63,117.35 55.63,116.5 D83.A
  Top 0.813: D83.A D99.A 55.56,103.7 55.88,103.38 58.67,103.38 59.44,104.14 | D115.A 55.56,95.31 55.69,95.31 56.13,95.76 59.44,95.76 59.69,95.5 | D66.A 52.97,127.55 C6.1
  pour Top (isolate 0.381): 52.07,106.17 52.2,93.98 72.52,93.98 72.64,106.17
  pour Top (isolate 0.381): 72.39,129.29 72.39,111.51 56.9,111.51 56.9,129.29
IR_RET3
  Top 0.61: L3.1 29.97,43.53 38.71,43.53 39.59,42.64 C14.2 40.74,42.77 41.88,42.77 42.13,43.02 42.13,44.8 42.26,44.93 48.82,44.93 49.93,43.81 50.64,43.81 arc45 50.82,43.89 C13.2 | D195.C 223.77,49.83 223.77,50.42 223.14,51.05 217.81,51.05 217.48,51.38 RGB48.T 217.48,59.37 217.81,59.69 223.52,59.69 223.9,60.07 223.9,60.81 D178.C | D146.C 223.85,82.62 223.27,82.04 217.93,82.04 217.49,81.6 RGB40.T 217.49,73.59 217.93,73.15 223.27,73.15 223.77,72.64 223.77,72.05 D162.C
  Top 0.813: D162.C 223.85,70.94 222.25,69.34 | 223.9,62.23 223.9,60.92 D178.C | C13.2 52.06,43.91 arc45 52.24,43.98 | 52.83,46 arc-45 52.91,46.18 | D195.C 223.85,48.08
  Top 1.27: 222.25,69.34 222.25,63.88 223.9,62.23 | 52.24,43.98 52.83,44.58 52.83,46 | 52.91,46.18 53.72,46.99 222.38,46.86 223.85,48.08
  pour Top (isolate 0.381): 209.04,62.99 209.04,48.51 224.15,48.51 224.15,51.31 217.68,51.31 217.68,59.44 224.15,59.44 224.15,62.99
  pour Top (isolate 0.381): 209.04,84.58 209.04,69.6 224.03,69.6 224.03,73.66 217.68,73.66 217.68,81.79 224.03,81.79 224.03,84.58
IR_RET_UL1
  Top 0.61: L1.1 30.48,136.5 39.21,136.5 40.1,135.61 C5.2 42.03,135.61 arc45 42.21,135.68 42.54,136.02 42.54,137.16 43.18,137.8 50.38,137.8 arc-45 50.56,137.72 C4.2 | 223.27,162.31 219.71,162.31
  Top 0.813: D32.C 223.85,160.58 arc-45 223.77,160.4 221.62,158.24 | 221.62,153.78 arc45 221.69,153.6 | 223.9,151.38 223.9,149.91 arc-45 D48.C 223.85,148.92 223.52,148.59 216.41,148.59 | C4.2 51.18,136.52 51.82,135.64 | 143.15,133.35 arc45 143.33,133.42 | 217.68,139.7 223.27,139.7 223.85,139.12 D65.C arc-45 223.9,138.53 223.9,137.16 | 132.42,135.57 132.4,135.57
  Top 0.914: D16.C 223.85,171.27 223.52,170.94 219.96,170.94 | D32.C 223.85,161.47 223.27,162.31
  Top 1.27: 221.62,158.24 221.62,153.78 | 221.69,153.6 223.9,151.38 | 51.82,135.64 132.42,135.57 | 143.15,133.35 134.62,133.35 132.4,135.57 | 143.33,133.42 145.92,136.02 222.76,135.89 223.9,137.16
  pour Top (isolate 0.254, no thermals): 209.55,173.86 209.68,158.75 224.54,158.75 224.54,162.56 220.34,162.56 220.34,170.69 224.41,170.69 224.41,173.86
  pour Top (isolate 0.381): 209.55,137.41 209.55,150.62 224.28,150.62 224.28,148.34 217.68,148.34 217.68,140.21 224.28,140.21 224.28,137.41
LGND
  Top 0.406: 4.42,133.07 4.29,132.94 | 14.7,133.07 P1.8
  Top 0.813: P1.10 11.73,133.1 11.43,133.1 | P2.10 11.94,41.86 11.94,41.66 | R17.1 30.22,97.41
  Top 1.016: P1.8 11.43,133.1 9.45,133.1 9.32,133.22 | 9.32,133.22 7.44,135.1 | 9.32,133.22 8.58,133.22 6.83,131.47 | P2.8 11.94,41.66 9.47,41.66 9.22,41.91 | 9.22,41.91 7.04,44.09 | 9.22,41.91 8.91,41.91 7.47,40.46 7.47,38.25 7.31,38.1 | 49.32,80.22 47.88,81.66
  Top 1.27: 30.22,97.41 29.84,97.03 23.75,97.03 23.75,96.65
  pour Top (isolate 0.508): -0.28,-3.2 -0.03,98.55 24.26,98.55 24.26,88.27 41.5,88.27 50.14,79.88 10.16,79.88 10.16,-3.58
  pour Top (isolate 0.381): 0.48,86.84 -0.41,179.17 10.16,179.04 10.16,86.46
N$1
  Top 0.914: RGB15.GA RGB16.GC
N$2
  Top 0.813: D228.A 221.49,26.67 221.11,26.29 213.87,26.29 212.73,27.42 D227.C
N$3
  Top 0.61: Q12.4 22.13,8.86 R68.1
N$4
  Top 0.61: 10.55,58.04 R41.2 | Q8.1 22.56,69.31 arc45 22.38,69.24 17.09,63.95 arc45 17.02,63.78 17.02,59.54 arc-45 16.94,59.36
  Top 0.914: 10.55,58.04 15.62,58.04 16.94,59.36
N$5
  Top 0.61: 46.83,22.56 JMP12.1 46.21,22.48
  Top 0.914: RGB49.GC 52.52,33.09 49.53,30.1 49.53,23.5 48.51,22.48 46.21,22.48
N$6  (1 unrouted)
  Top 0.61: 29.69,25.37 29.43,25.12 29.94,24.61 28.62,24.61 Q10.78 | Q10.7 31.85,24.74 33.12,26.01 32.64,26.01 | Q10.8 32.26,26.01 | 32.26,26.01 32.64,26.01 | 32.29,26.04 32.26,26.01 | 32.79,26.16 32.64,26.01
  Top 0.813: 59.52,34.53 59.68,34.53 60.71,35.56 RGB49.BC
  Top 0.914: 32.79,26.16 42.93,26.16 51.42,34.53 59.52,34.53
N$7
  Top 0.914: RGB14.GA RGB15.GC
N$8
  Top 0.305: Q10.6 29.56,23.47 29.43,23.59
  Top 0.61: Q10.56 28.67,22.83 29.43,23.59 32.86,23.59 | 32.86,23.59 33.24,23.59 | 42.52,24.74 44.17,23.08 44.17,17.12 | Q10.5 32.23,22.2 32.86,22.83 32.86,23.59 | 48.6,12.69 48.65,12.69
  Top 0.914: 33.24,23.59 34.39,24.74 42.52,24.74 | 48.6,12.69 44.17,17.12 | 48.65,12.69 49.15,12.19 59.66,12.19 RGB57.BC
N$9
  Top 0.61: R47.2 11.6,45.44 23.59,45.44 25.65,47.5 25.65,55.22 24.48,56.36 22.7,56.36 22.32,56.74 22.32,59.15 22.58,59.41 Q9.3
N$10
  Top 0.61: R42.1 25.84,57.69 Q9.4
N$11
  Top 0.61: Q8.2 23.78,68.04 R40.2
N$12
  Top 0.914: RGB13.GA RGB14.GC
N$13
  Top 0.914: RGB12.GA RGB13.GC
N$14
  Top 0.813: D139.A 144.4,83.03 144.4,82.93 143.76,82.3 141.29,82.3 R35.1
N$15
  Top 0.305: Q12.7 28.5,11.4 Q12.78
  Top 0.61: Q12.8 33.24,12.67 33.24,12.04 32.61,11.4 Q12.7
  Top 0.914: 33.24,12.67 33.5,12.67 39.53,18.7 JMP13.2
N$16
  Top 0.305: Q11.8 28.5,19.15 Q11.78
  Top 0.61: Q11.8 33.5,19.15 | 40.63,21.81 JMP12.2 40.85,22.48 | Q11.7 32.86,17.88 33.24,18.26 33.24,18.89 33.5,19.15 | 33.5,19.15 33.5,19.28
  Top 0.914: 33.5,19.28 36.7,22.48 40.85,22.48
N$17
  Top 0.813: D138.C 134.97,83.09 135.89,82.17 138.11,82.17 R35.2
N$18
  Top 0.813: R38.2 135.01,71.92 D154.C
N$19
  Top 0.813: D155.A 141.32,71.98 R38.1
N$20
  Top 0.813: 59.28,31.75 60.32,30.73 60.52,30.54 RGB49.RC
  Top 0.914: JMP13.1 48.68,18.7 51.18,21.21 51.18,29.21 53.72,31.75 59.28,31.75
N$21
  Top 0.813: R43.1 144.4,60.8 D171.A
N$22
  Top 0.813: R43.2 135.01,60.8 D170.C
N$23
  Top 0.813: D188.A 141.45,49.76 R46.1
N$24
  Top 0.813: R46.2 135.01,49.82 D187.C
N$25
  Top 0.813: D203.C 134.95,39.19 137.54,41.78 137.86,41.78 R57.2
N$26
  Top 0.813: RGB64.BC 219.04,14 217.42,15.62 214.88,15.62 211.84,12.57 197.14,12.57 RGB63.BA
N$27
  Top 0.61: L4.2 29.69,36.8 33.75,36.8 34.24,37.41 D212.A | U4.5 36.85,38.2 D212.A | U4.6 36.75,36.93 D212.A
N$29
  Top 0.61: 31.11,29.31 L4.1 | C18.2 40.74,29.18 39.85,29.18 C18.2
  Top 0.914: C18.2 31.11,29.31 | R55.1 47.72,36.17 40.74,29.18
N$30
  Top 0.813: RGB64.RC 218.69,8.38 218.44,8.13 213.87,8.13 212.34,9.65 197.65,9.65 RGB63.RA
N$31
  Top 0.813: D204.A 144.27,38.83 144.27,40.26 142.75,41.78 arc-45 142.81,41.75 R57.1
N$32
  Top 0.813: D221.A 141.58,27.53 R60.1
N$33
  Top 0.813: R60.2 135.01,27.59 D220.C
N$34
  Top 0.813: R64.1 144.4,16.48 D237.A
N$35
  Top 0.406: Q10.4 21.94,22.2 R62.1
N$36
  Top 0.61: R58.2 11.79,35.28 22.7,35.28 23.47,34.9 23.47,32.99 20.07,29.59 20.07,24.13 20.73,23.47 Q10.3
N$37
  Top 0.813: D236.C 138.66,16.42 R64.2
N$38
  Top 0.813: D253.A 142.21,5.31 R67.1
N$39
  Top 0.813: D252.C 138.02,5.31 R67.2
N$40
  Top 0.914: RGB11.GA RGB12.GC
N$41
  Top 0.914: RGB10.GA RGB11.GC
N$42
  Top 0.914: RGB9.GA RGB10.GC
N$43
  Top 0.914: RGB16.RC 215.65,141.73 214.38,143 198.12,143 196.79,141.67 RGB15.RA
N$44
  Top 0.914: RGB15.RC 193.29,141.73 192.02,143 176.02,143 174.69,141.67 RGB14.RA
N$45
  Top 0.914: RGB14.RC 171.45,141.73 170.18,143 153.67,143 152.34,141.67 RGB13.RA
N$46
  Top 0.914: RGB12.RA 130.5,141.67 131.83,143 147.57,143 148.84,141.73 149.7,141.73 RGB13.RC
N$47
  Top 0.914: RGB12.RC 126.75,141.73 125.48,143 109.47,143 108.14,141.67 RGB11.RA
N$48
  Top 0.914: RGB11.RC 104.39,141.73 103.12,143 87.12,143 85.79,141.67 RGB10.RA
N$49
  Top 0.914: RGB10.RC 82.55,141.73 81.53,142.75 65.02,142.75 63.95,141.67 RGB9.RA
N$50
  Top 0.914: RGB10.BC 82.55,146.56 81.53,145.54 65.02,145.54 63.81,146.75 RGB9.BA
N$51
  Top 0.914: RGB10.BA 86.17,146.75 87.38,145.54 103.63,145.54 104.65,146.56 105.12,146.56 RGB11.BC
N$52
  Top 0.914: RGB12.BC 127.25,146.81 125.98,145.54 109.22,145.54 108.01,146.75 RGB11.BA
N$53
  Top 0.914: RGB12.BA 130.87,146.75 132.08,145.54 147.57,145.54 148.84,146.81 149.7,146.81 RGB13.BC
N$54
  Top 0.914: RGB14.BC 171.45,146.81 170.18,145.54 153.42,145.54 152.21,146.75 RGB13.BA
N$55
  Top 0.914: RGB15.BC 193.55,146.81 192.28,145.54 176.02,145.54 174.81,146.75 RGB14.BA
N$56
  Top 0.914: RGB16.BC 215.65,146.56 214.63,145.54 198.12,145.54 196.91,146.75 RGB15.BA
N$57
  Top 0.813: D52.A D51.C
N$58
  Top 0.813: D53.A 88.39,138.18 87.88,137.67 81.03,137.67 80.04,138.66 D52.C
N$59
  Top 0.813: D55.A 110.24,137.92 109.98,137.67 103.12,137.67 102.14,138.66 D54.C
N$60
  Top 0.813: D57.A 132.33,137.92 132.08,137.67 125.22,137.67 124.23,138.66 D56.C
N$61
  Top 0.813: D51.A 66.04,138.18 65.53,137.67 58.93,137.67 57.94,138.66 D50.C
N$62
  Top 0.813: D54.A D53.C
N$63
  Top 0.813: D56.A D55.C
N$64
  Top 0.813: D60.A D59.C
N$65
  Top 0.813: D61.A 176.53,137.67 169.42,137.67 168.36,138.72 168.35,138.72 D60.C
N$66
  Top 0.813: D63.A 198.63,137.67 192.53,137.67 191.54,138.66 D62.C
N$67
  Top 0.61: U3.6 U3.5 35.4,51.41 D179.A 34.72,51.28 33.88,51.28 30.93,51.25 L3.2
N$68
  Top 0.813: D65.A 221.49,137.92 221.23,137.67 214.12,137.67 213.13,138.66 D64.C
N$69
  Top 0.813: D59.A 154.69,137.92 154.43,137.67 147.32,137.67 146.33,138.66 D58.C
N$70
  Top 0.813: D62.A 179.53,138.66 D61.C
N$71
  Top 0.813: D64.A D63.C
N$72
  Top 0.813: D34.C D35.A
N$73
  Top 0.813: D35.C 79.42,149.77 80.77,151.13 87.63,151.13 D36.A
N$74
  Top 0.813: D37.C 101.77,149.77 103.12,151.13 109.98,151.13 D38.A
N$75
  Top 0.813: D39.C 123.87,149.77 125.22,151.13 132.08,151.13 D40.A
N$76
  Top 0.813: D33.C 57.32,149.77 58.67,151.13 65.53,151.13 D34.A
N$77
  Top 0.813: D36.C D37.A
N$78
  Top 0.813: D38.C D39.A
N$79
  Top 0.813: D42.C D43.A
N$80
  Top 0.813: D43.C 168.32,149.77 169.67,151.13 176.53,151.13 176.78,150.88 177.79,149.77 D44.A
N$81
  Top 0.813: D45.C 190.51,149.87 191.77,151.13 198.88,151.13 199.14,150.88 D46.A
N$82
  Top 0.813: D47.C 213.02,149.77 214.38,151.13 220.22,151.13 220.98,150.37 221.66,149.77 221.74,149.86 222.16,149.86 D48.A
N$83
  Top 0.813: D41.C 146.47,149.77 147.83,151.13 154.18,151.13 D42.A
N$84
  Top 0.813: D44.C 188.84,149.84 D45.A
N$85
  Top 0.813: D46.C D47.A
N$86
  Top 0.813: RGB23.GA RGB24.GC
N$87
  Top 0.813: RGB22.GA RGB23.GC
N$88
  Top 0.813: RGB21.GA RGB22.GC
N$89
  Top 0.813: RGB20.GA RGB21.GC
N$90
  Top 0.813: RGB20.GC RGB19.GA
N$91
  Top 0.813: RGB18.GA RGB19.GC
N$92
  Top 0.813: RGB17.GA RGB18.GC
N$93
  Top 0.813: RGB23.RA 196.85,119.63 198.12,120.9 214.63,120.9 216.09,119.45 RGB24.RC
N$94
  Top 0.813: RGB22.RA 174.56,119.45 176.02,120.9 192.28,120.9 193.8,119.38 RGB23.RC
N$95
  Top 0.813: RGB21.RA 152.72,119.45 153.92,120.65 170.18,120.65 171.2,119.63 RGB22.RC
N$96
  Top 0.813: RGB20.RA 130.11,119.45 131.57,120.9 147.83,120.9 149.35,119.38 RGB21.RC
N$97
  Top 0.813: RGB47.GA RGB48.GC
N$98
  Top 0.813: RGB19.RA 107.51,119.45 108.97,120.9 125.22,120.9 126.75,119.38 RGB20.RC
N$99
  Top 0.813: RGB18.RA 85.66,119.45 87.12,120.9 103.38,120.9 104.9,119.38 RGB19.RC
N$100
  Top 0.813: RGB17.RA 63.57,119.45 65.02,120.9 81.03,120.9 82.55,119.38 RGB18.RC
N$101
  Top 0.813: RGB17.BA 63.75,124.46 65.02,123.19 81.28,123.19 82.62,124.53 RGB18.BC
N$102
  Top 0.813: RGB18.BA 85.85,124.46 87.12,123.19 103.38,123.19 104.71,124.53 RGB19.BC
N$103
  Top 0.813: RGB19.BA 107.7,124.46 108.97,123.19 125.73,123.19 127.07,124.53 RGB20.BC
N$104
  Top 0.813: RGB20.BA 130.3,124.46 131.57,123.19 147.83,123.19 149.16,124.53 RGB21.BC
N$105
  Top 0.813: RGB21.BA 152.65,124.46 153.92,123.19 170.18,123.19 171.52,124.53 RGB22.BC
N$106
  Top 0.813: RGB22.BA 174.5,124.46 175.77,123.19 192.28,123.19 193.61,124.53 RGB23.BC
N$107
  Top 0.813: RGB23.BA 196.78,124.53 198.12,123.19 214.88,123.19 216.22,124.53 RGB24.BC
N$108
  Top 0.813: D67.C D68.A
N$109
  Top 0.813: D68.C 79.54,127.55 80.52,128.52 87.88,128.52 D69.A
N$110